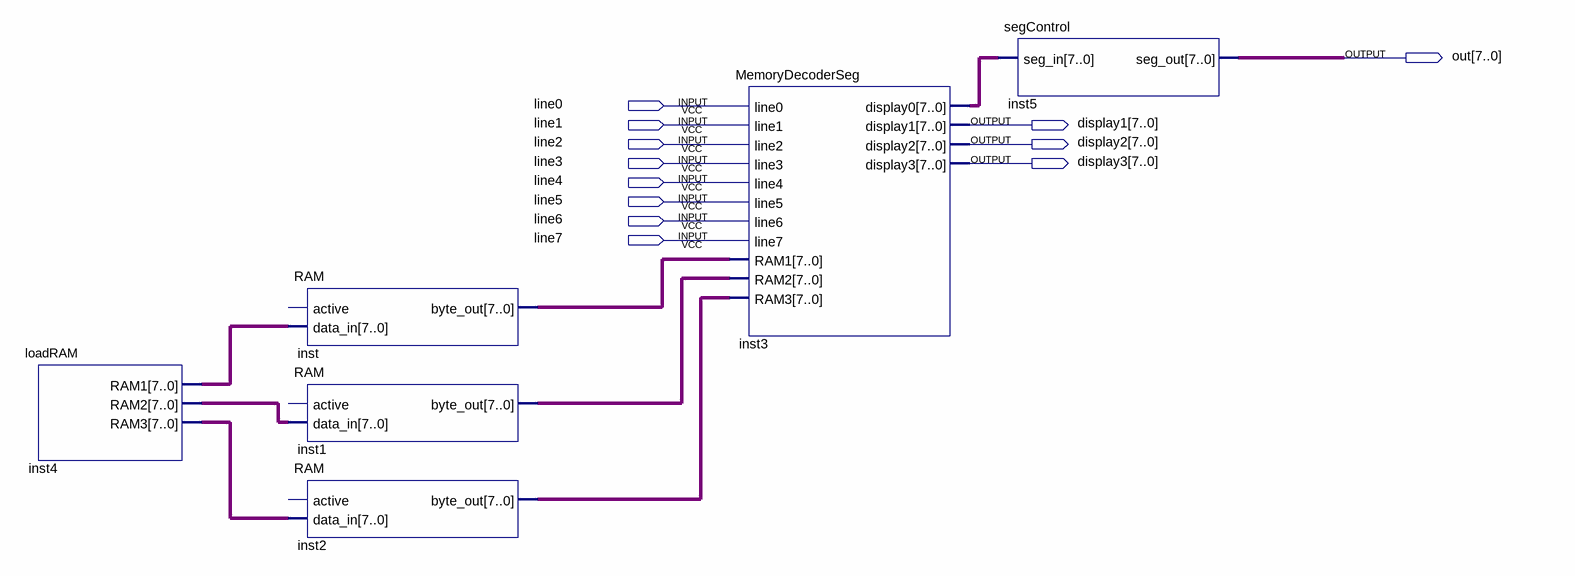
[diagram p0: schematic sheet]
// Quartus schematic loadData.bdf as structural Verilog: 6 symbols, 12 pins
module loadData (
  input  line0,
  input  line1,
  input  line2,
  input  line3,
  input  line4,
  input  line5,
  input  line6,
  input  line7,
  output [7:0] out,
  output [7:0] display1,
  output [7:0] display2,
  output [7:0] display3
);

  wire [7:0] inst1_byte_out, inst2_byte_out, inst3_display0, inst4_ram1, inst4_ram2, inst4_ram3,
       inst_byte_out;

  loadRAM inst4 (.RAM1(inst4_ram1), .RAM2(inst4_ram2), .RAM3(inst4_ram3));
  RAM inst (.data_in(inst4_ram1), .byte_out(inst_byte_out));  // open: active
  RAM inst1 (.data_in(inst4_ram2), .byte_out(inst1_byte_out));  // open: active
  RAM inst2 (.data_in(inst4_ram3), .byte_out(inst2_byte_out));  // open: active
  MemoryDecoderSeg inst3 (
    .line0(line0), .line1(line1), .line2(line2), .line3(line3), .line4(line4), .line5(line5), .line6(line6),
    .line7(line7), .RAM1(inst_byte_out), .RAM2(inst1_byte_out), .RAM3(inst2_byte_out),
    .display0(inst3_display0), .display1(display1), .display2(display2), .display3(display3));
  segControl inst5 (.seg_in(inst3_display0), .seg_out(out));
endmodule
